# EAGLE design MAX31855 (EAGLE 5.11)
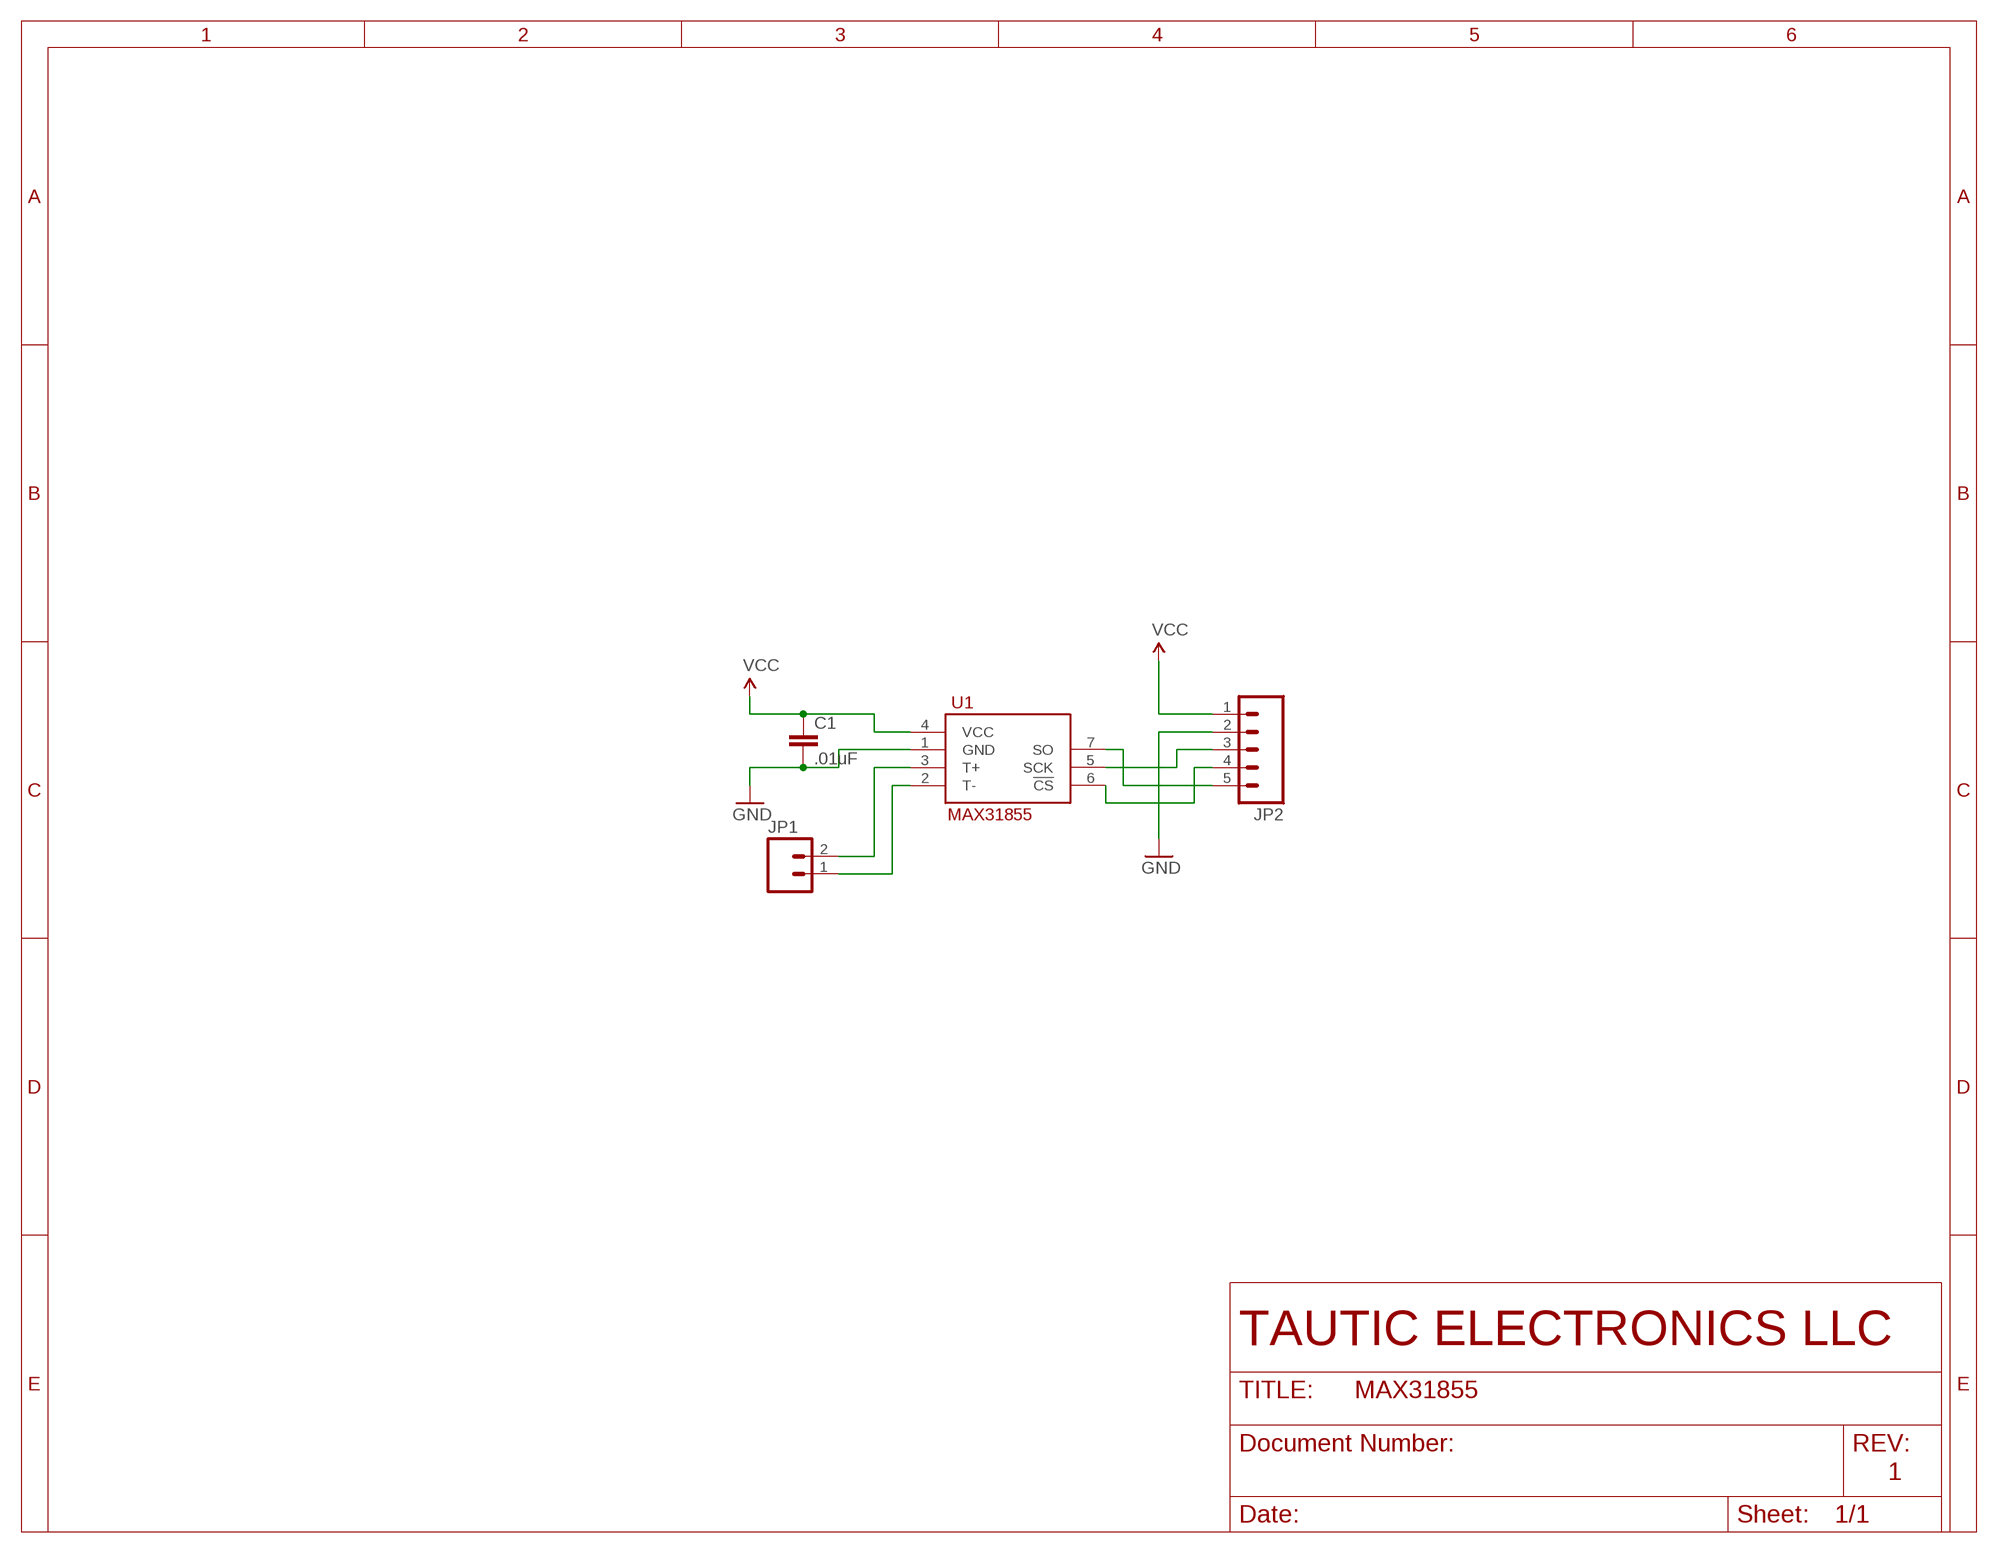
[diagram p0: schematic, sheet 1]

## Parts
C1  .01uF  CAP0805  [0805]
JP1  M02PTH  [1X02]
JP2  M05PTH  [1X05]
U1  MAX31855  MAX6675  [SO08]

## Nets
CS: JP2.4 U1.6(!CS!)
GND: C1.2 JP2.2 U1.1(GND)
SCK: JP2.3 U1.5(SCK)
SO: JP2.5 U1.7(SO)
T+: JP1.2 U1.3(T+)
T-: JP1.1 U1.2(T-)
VCC: C1.1 JP2.1 U1.4(VCC)

## Notes on the sheet
- TAUTIC ELECTRONICS LLC
- 1

## Library data of the parts
C1 = SparkFun:CAP: Capacitor Standard 0603 ceramic capacitor, and 0.1" leaded capacitor.
JP1 = SparkFun:M02: Header 2 Standard 2-pin 0.1" header. Use with straight break away headers (SKU : PRT-00116), right angle break away headers (PRT-00553), swiss pins (PRT-00743), machine pins (PRT-00117), and female headers (PRT-00115). Molex polarized connector foot print use with SKU : PRT-08233 with associated crimp pins and housings.
JP2 = SparkFun:M05: Header 5 Standard 5-pin 0.1" header. Use with straight break away headers (SKU : PRT-00116), right angle break away headers (PRT-00553), swiss pins (PRT-00743), machine pins (PRT-00117), and female headers (PRT-00115). Molex polarized connector foot print use with SKU : PRT-08230 with associated crimp pins and housings.
U1 = SparkFun:MAX6675

## Board
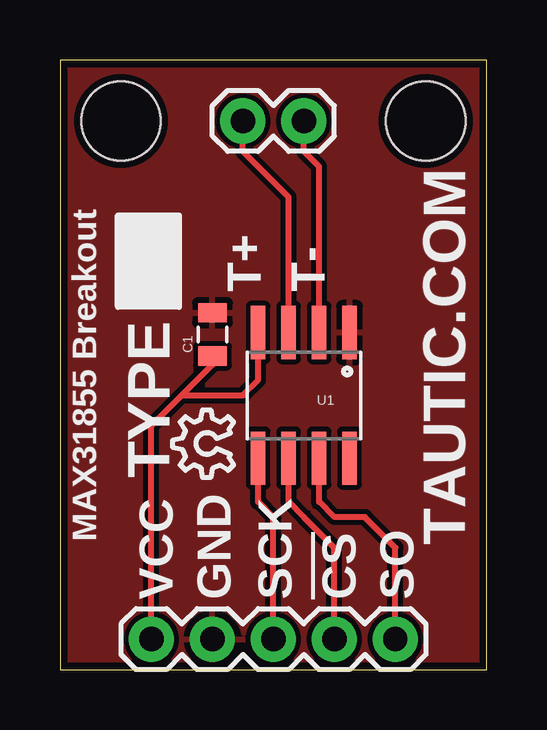
[diagram p1: board, top side]
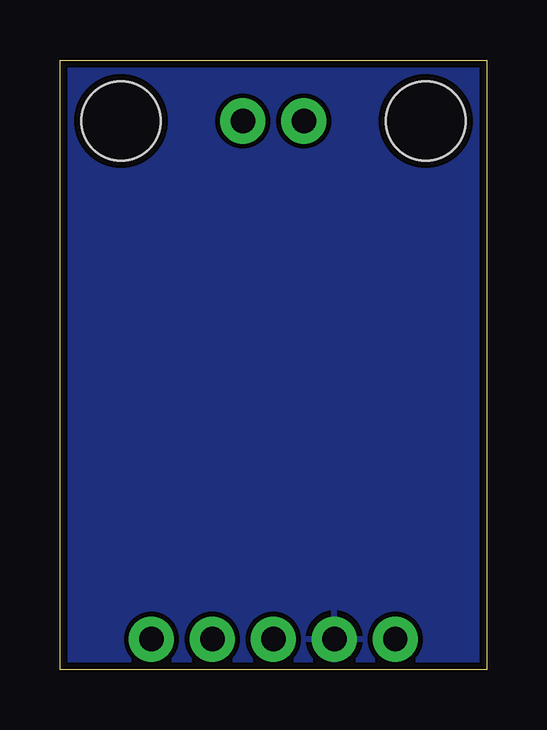
[diagram p2: board, bottom side, seen from below]

Size 17.78 x 25.4 mm. Coordinates in mm from the lower left corner, seen from the top.
Outline: 0,0 17.78,0 17.78,25.4 0,25.4 0,0
Copper layers (1*16): Top 0.035mm / dielectric 1.5mm / Bottom 0.035mm
Design rules "default *": minimum track width 10mil, minimum drill 24mil, track to track 8mil, track to pad 8mil, pad to pad 8mil, via to via 8mil, smd to smd 8mil, copper to edge 12mil, drill to drill 8mil, minimum pad ring 10mil, minimum via ring 8mil, stop-mask expansion 4mil, vias tented up to drill 0mil, thermal gap 10mil
Holes 3.3 mm at 2.54,22.86 15.24,22.86

### Footprints (pad centres in the part's own frame; a part is rotated, then mirrored left to right if it is on the bottom)
0805 = smd 0.8 x 1.2: 1 -0.9,0; 2 0.9,0
1X02 = drill 1.016 pad 1.88 round: 1 0,0; 2 2.54,0
1X05 = drill 1.016 pad 1.88 round: 1 0,0; 2 2.54,0; 3 5.08,0; 4 7.62,0; 5 10.16,0
SO08 = smd 0.61 x 2.21: 1 -1.905,-2.616; 2 -0.635,-2.616; 3 0.635,-2.616; 4 1.905,-2.616; 5 1.905,2.616; 6 0.635,2.616; 7 -0.635,2.616; 8 -1.905,2.616

### Placement (x,y rotation side)
C1  6.35,13.97 90 top
JP1  10.16,22.86 180 top
JP2  3.81,1.27 0 top
U1  10.16,11.43 180 top
U$1  [OSHW_8X100_NOTEXT]  7.24,8 90 top

### Tracks (layer width: path | path; a pad name or v marks a point on that pad's centre or on a via)
CS
  Top 0.254: U1.6 9.53,6.99 10.16,6.35 11.43,5.08 JP2.4
GND
  pour Bottom: -1.27,-1.27 -1.27,26.67 20.32,26.67 20.32,-1.27
  pour Top: -2.54,29.21 21.59,29.21 21.59,-2.54 -2.54,-2.54
SCK
  Top 0.254: U1.5 8.26,6.99 8.89,6.35 JP2.3
SO
  Top 0.254: U1.7 10.79,6.99 11.43,6.35 12.7,6.35 13.97,5.08 JP2.5
T+
  Top 0.254: U1.3 9.53,19.68 7.62,21.59 JP1.2
T-
  Top 0.254: U1.2 10.79,20.95 10.16,21.59 JP1.1
VCC
  Top 0.254: U1.4 8.26,12.06 7.62,11.43 5.08,11.43 | 5.08,11.43 3.81,10.16 JP2.1 | C1.1 6.35,12.7 5.08,11.43

### Text on the board
tPlace: T+ | T- | TYPE | MAX31855 Breakout | TAUTIC.COM | VCC | GND | SCK | !CS! | SO